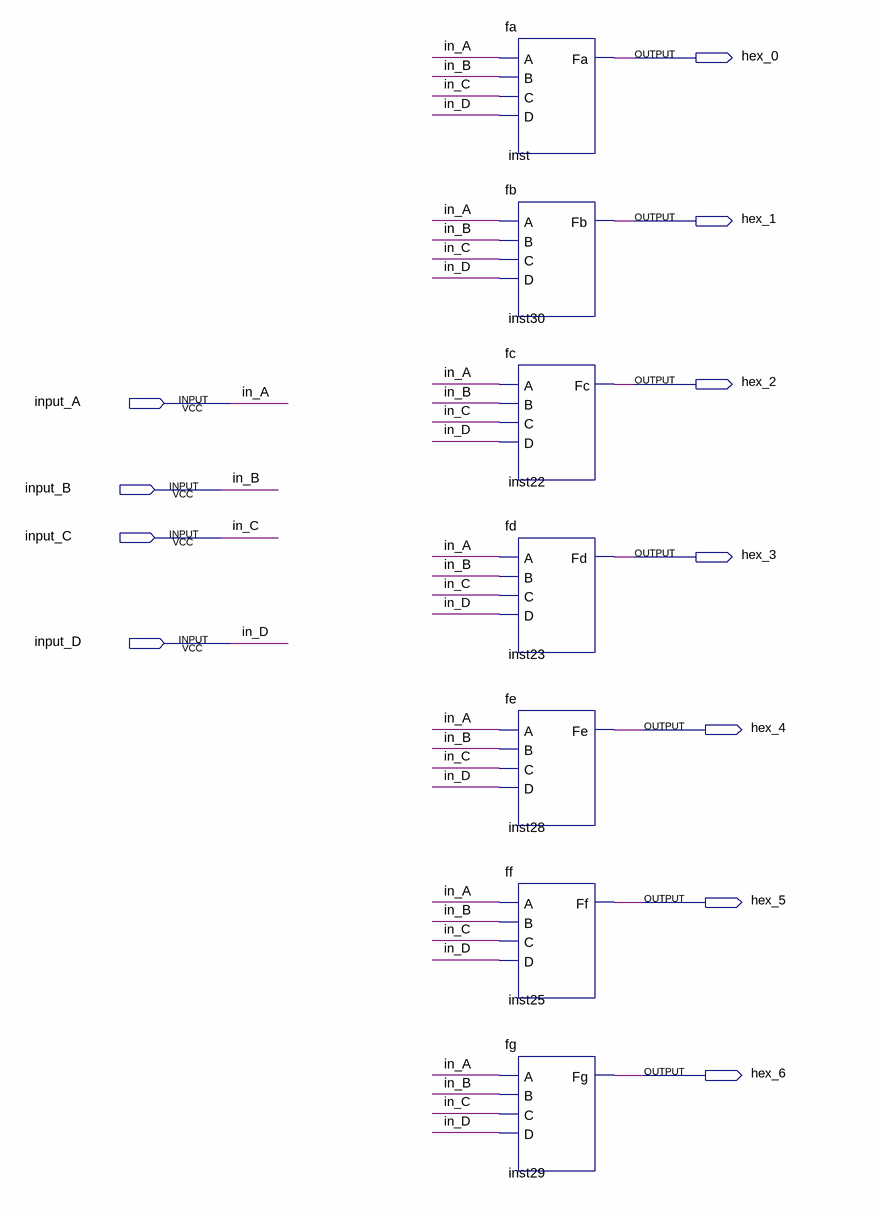
[diagram p0: schematic sheet]
// Quartus schematic decodificador_bin_hex_7seg.bdf as structural Verilog: 7 symbols, 11 pins
module decodificador_bin_hex_7seg (
  input  input_A,
  input  input_B,
  input  input_C,
  input  input_D,
  output hex_0,
  output hex_1,
  output hex_2,
  output hex_3,
  output hex_4,
  output hex_5,
  output hex_6
);

  fa inst (.A(input_A), .B(input_B), .C(input_C), .D(input_D), .Fa(hex_0));
  fb inst30 (.A(input_A), .B(input_B), .C(input_C), .D(input_D), .Fb(hex_1));
  fc inst22 (.A(input_A), .B(input_B), .C(input_C), .D(input_D), .Fc(hex_2));
  fd inst23 (.A(input_A), .B(input_B), .C(input_C), .D(input_D), .Fd(hex_3));
  fe inst28 (.A(input_A), .B(input_B), .C(input_C), .D(input_D), .Fe(hex_4));
  ff inst25 (.A(input_A), .B(input_B), .C(input_C), .D(input_D), .Ff(hex_5));
  fg inst29 (.A(input_A), .B(input_B), .C(input_C), .D(input_D), .Fg(hex_6));

  // Other names for the same wires on the sheet: in_A = input_A; in_B = input_B; in_C = input_C; in_D = input_D
endmodule
